# EAGLE design iotpanel (EAGLE 6.4)
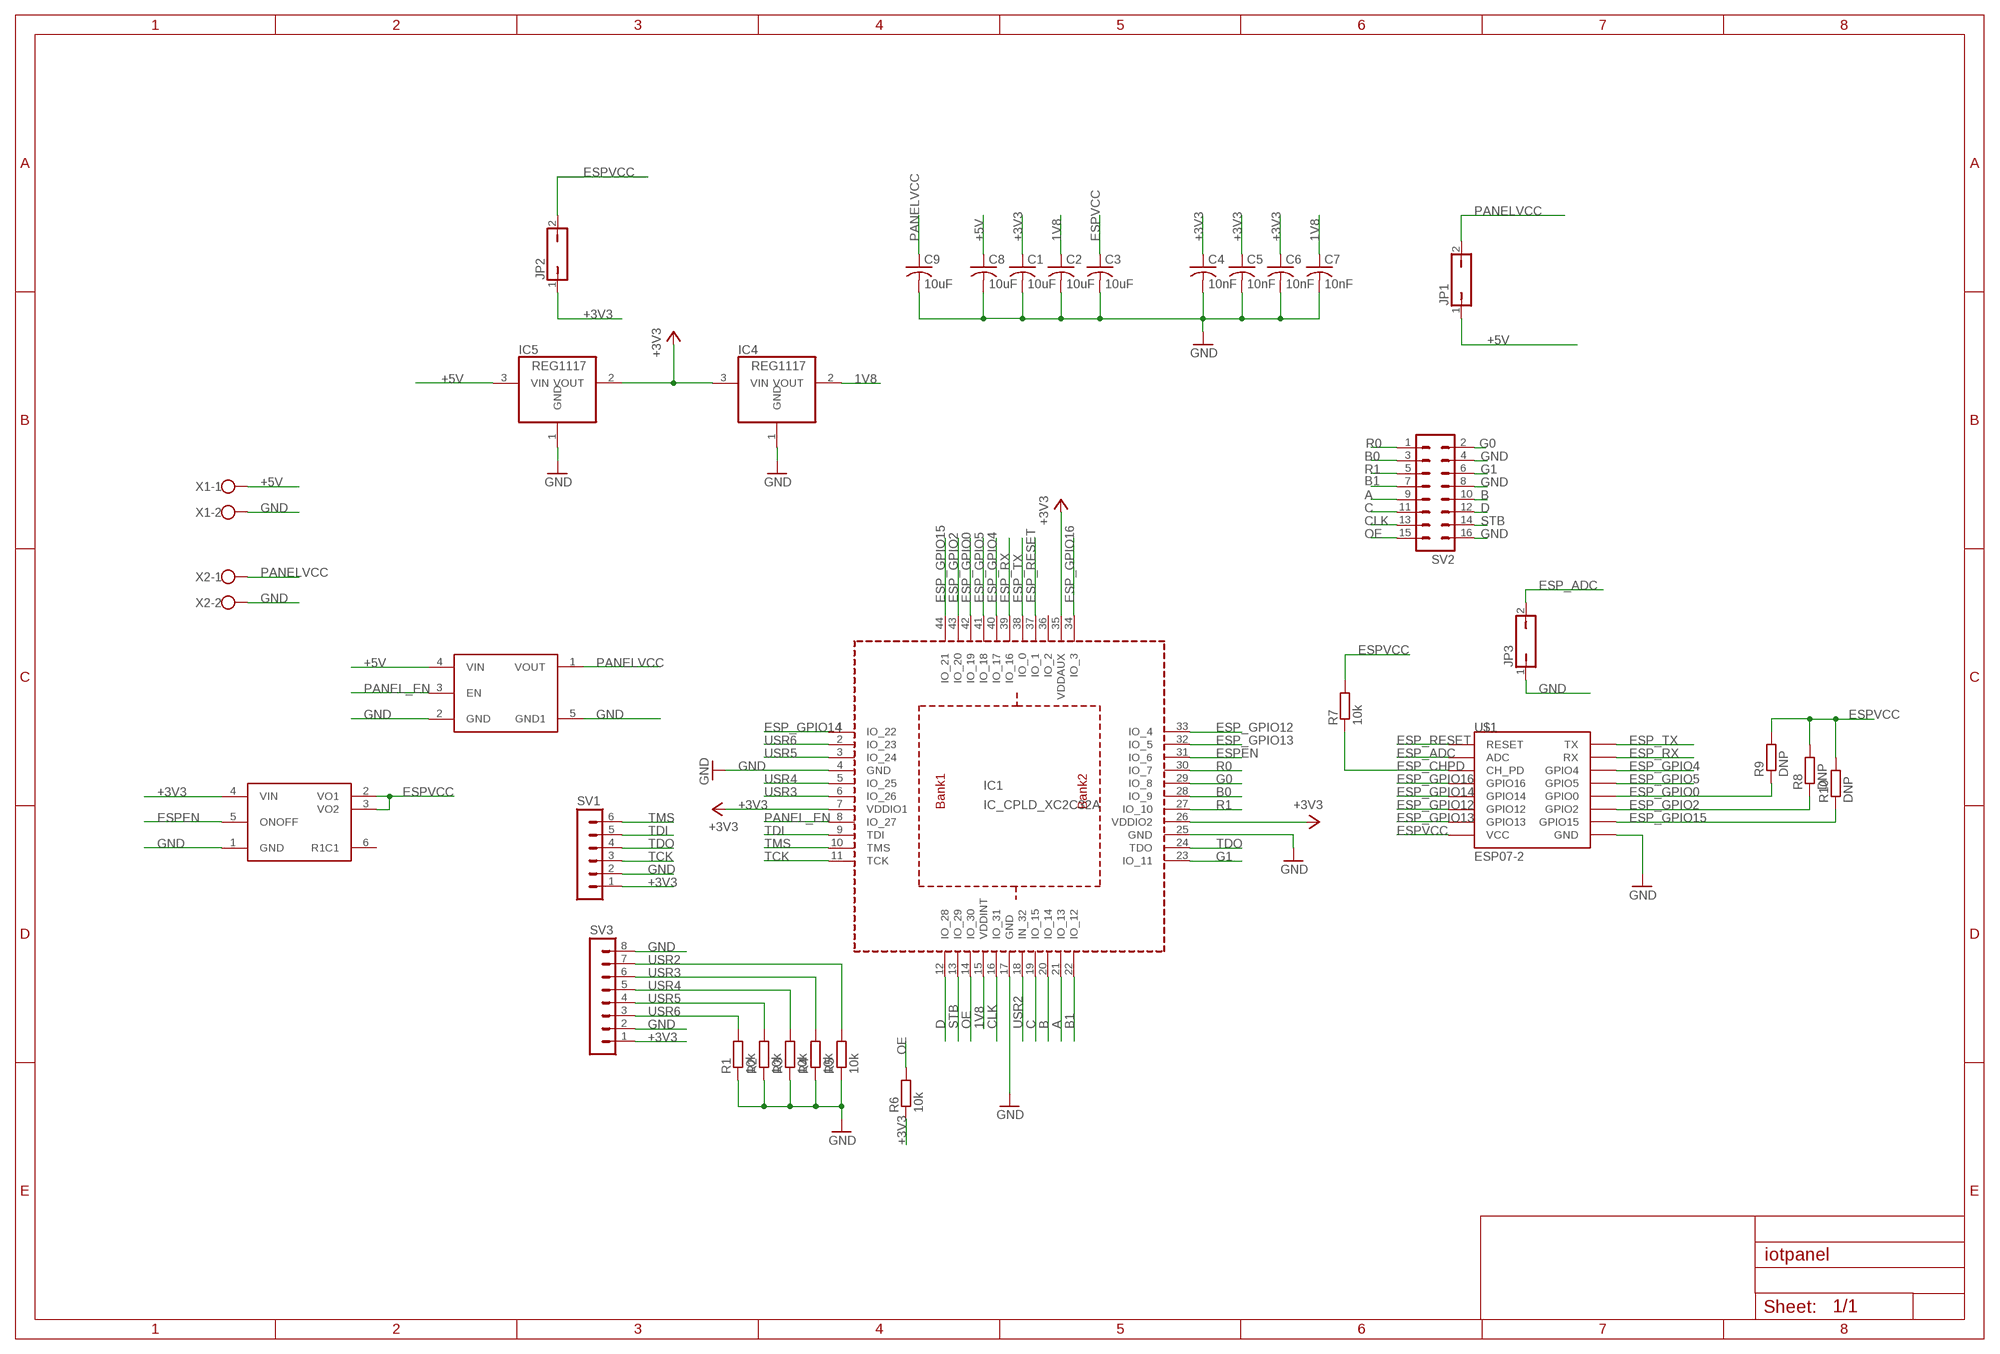
[diagram p0: schematic, sheet 1]

## Parts
C1  10uF  CAPACITOR_-0805  [CAPC0805]
C2  10uF  CAPACITOR_-0805  [CAPC0805]
C3  10uF  CAPACITOR_-0805  [CAPC0805]
C4  10nF  CAPACITOR_-0805  [CAPC0805]
C5  10nF  CAPACITOR_-0805  [CAPC0805]
C6  10nF  CAPACITOR_-0805  [CAPC0805]
C7  10nF  CAPACITOR_-0805  [CAPC0805]
C8  10uF  CAPACITOR_-0805  [CAPC0805]
C9  10uF  CAPACITOR_-0805  [CAPC0805]
IC1  IC_CPLD_XC2C32A  [VQ-44]
IC4  REG1117  [SOT223]
IC5  REG1117  [SOT223]
JP1  JP1Q  [JP1]
JP2  JP1Q  [JP1]
JP3  JP1Q  [JP1]
R1  10k  R-EU_R0805  [R0805]
R2  10k  R-EU_R0805  [R0805]
R3  10k  R-EU_R0805  [R0805]
R4  10k  R-EU_R0805  [R0805]
R5  10k  R-EU_R0805  [R0805]
R6  10k  R-EU_R0805  [R0805]
R7  10k  R-EU_R0805  [R0805]
R8  DNP  R-EU_R0805  [R0805]
R9  DNP  R-EU_R0805  [R0805]
R10  DNP  R-EU_R0805  [R0805]
SV1  MA06-1  [MA06-1]
SV2  ML16  [ML16]
SV3  MA08-1  [MA08-1]
U$1  ESP07-2  [ESP07-2]
U$2  MIC9406XBC6  [SC70-6L]
U$3  SI1867DL  [SC70-6L]
X1  W237-102  [W237-102]
X2  W237-102  [W237-102]

## Nets
1V8: C2.1 C7.1 IC1.15(VDDINT) IC4.2(VOUT)
+3V3: C1.1 C4.1 C5.1 C6.1 IC1.7(VDDIO1) IC1.26(VDDIO2) IC1.35(VDDAUX) IC4.3(VIN) IC5.2(VOUT) JP2.1 R6.1 SV1.1 SV3.1 U$3.4(VIN)
+5V: C8.1 IC5.3(VIN) JP1.1 U$2.4(VIN) X1.1
A: IC1.21(IO_13) SV2.9
B: IC1.20(IO_14) SV2.10
B0: IC1.28(IO_9) SV2.3
B1: IC1.22(IO_12) SV2.7
C: IC1.19(IO_15) SV2.11
CLK: IC1.16(IO_31) SV2.13
D: IC1.12(IO_28) SV2.12
ESP_ADC: JP3.2 U$1.ADC
ESP_CHPD: R7.1 U$1.CH_PD
ESP_GPIO0: IC1.42(IO_19) R9.1 U$1.GPIO0
ESP_GPIO2: IC1.43(IO_20) R8.1 U$1.GPIO2
ESP_GPIO4: IC1.40(IO_17) U$1.GPIO4
ESP_GPIO5: IC1.41(IO_18) U$1.GPIO5
ESP_GPIO12: IC1.33(IO_4) U$1.GPIO12
ESP_GPIO13: IC1.32(IO_5) U$1.GPIO13
ESP_GPIO14: IC1.1(IO_22) U$1.GPIO14
ESP_GPIO15: IC1.44(IO_21) R10.1 U$1.GPIO15
ESP_GPIO16: IC1.34(IO_3) U$1.GPIO16
ESP_RESET: IC1.37(IO_1) U$1.REST(RESET)
ESP_RX: IC1.39(IO_16) U$1.RX
ESP_TX: IC1.38(IO_0) U$1.TX
ESPEN: IC1.31(IO_6) U$3.5(ONOFF)
ESPVCC: C3.1 JP2.2 R7.2 R8.2 R9.2 R10.2 U$1.VCC U$3.2(VO1) U$3.3(VO2)
G0: IC1.29(IO_8) SV2.2
G1: IC1.23(IO_11) SV2.6
GND: C1.2 C2.2 C3.2 C4.2 C5.2 C6.2 C7.2 C8.2 C9.2 IC1.4(GND) IC1.17(GND) IC1.25(GND) IC4.1(GND) IC5.1(GND) JP3.1 R1.1 R2.1 R3.1 R4.1 R5.1 SV1.2 SV2.4 SV2.8 SV2.16 SV3.2 SV3.8 U$1.GND U$2.2(GND) U$2.5(GND1) U$3.1(GND) X1.2 X2.2
OE: IC1.14(IO_30) R6.2 SV2.15
PANEL_EN: IC1.8(IO_27) U$2.3(EN)
PANELVCC: C9.1 JP1.2 U$2.1(VOUT) X2.1
R0: IC1.30(IO_7) SV2.1
R1: IC1.27(IO_10) SV2.5
STB: IC1.13(IO_29) SV2.14
TCK: IC1.11(TCK) SV1.3
TDI: IC1.9(TDI) SV1.5
TDO: IC1.24(TDO) SV1.4
TMS: IC1.10(TMS) SV1.6
USR2: IC1.18(IN_32) R5.2 SV3.7
USR3: IC1.6(IO_26) R4.2 SV3.6
USR4: IC1.5(IO_25) R3.2 SV3.5
USR5: IC1.3(IO_24) R2.2 SV3.4
USR6: IC1.2(IO_23) R1.2 SV3.3
Unconnected: IC1.36(IO_2) U$3.6(R1C1)

## Library data of the parts
C1-C9 = EAGLE_BoosterPack_Library:CAPACITOR_
IC1 = dp_devices:IC_CPLD_XC2C32A: xc2c32a_vq44-ian edit this description Auto generated by make-symbol-device-package-bsdl.ulp Rev. 29 Source: xc2c32a_vq44-ian.bsd
IC4 IC5 = burr-brown:REG1117: 800mA and 1A Low Dropout (LDO) Positive Regulator 1.8V, 2.5V, 2.85V, 3.3V, 5V, and Adj; MPN: REG1117; OC_FARNELL: 1097566; OC_NEWARK: 14P6981
JP1-JP3 = jumper:JP1Q: JUMPER
R1-R10 = rcl:R-EU_: RESISTOR, European symbol
SV1 = con-lstb:MA06-1: PIN HEADER; OC_FARNELL: unknown; OC_NEWARK: unknown
SV2 = con-ml:ML16: HARTING; PARTNO: PRPC004DAAN-RC
SV3 = con-lstb:MA08-1: PIN HEADER; OC_FARNELL: unknown; OC_NEWARK: unknown
U$1 = esp8266modules:ESP07-2
U$2 = alvie:MIC9406XBC6
U$3 = alvie:SI1867DL
X1 X2 = con-wago-500:W237-102: WAGO SCREW CLAMP; MPN: 237-102; OC_FARNELL: unknown; OC_NEWARK: 70K9898

## Board
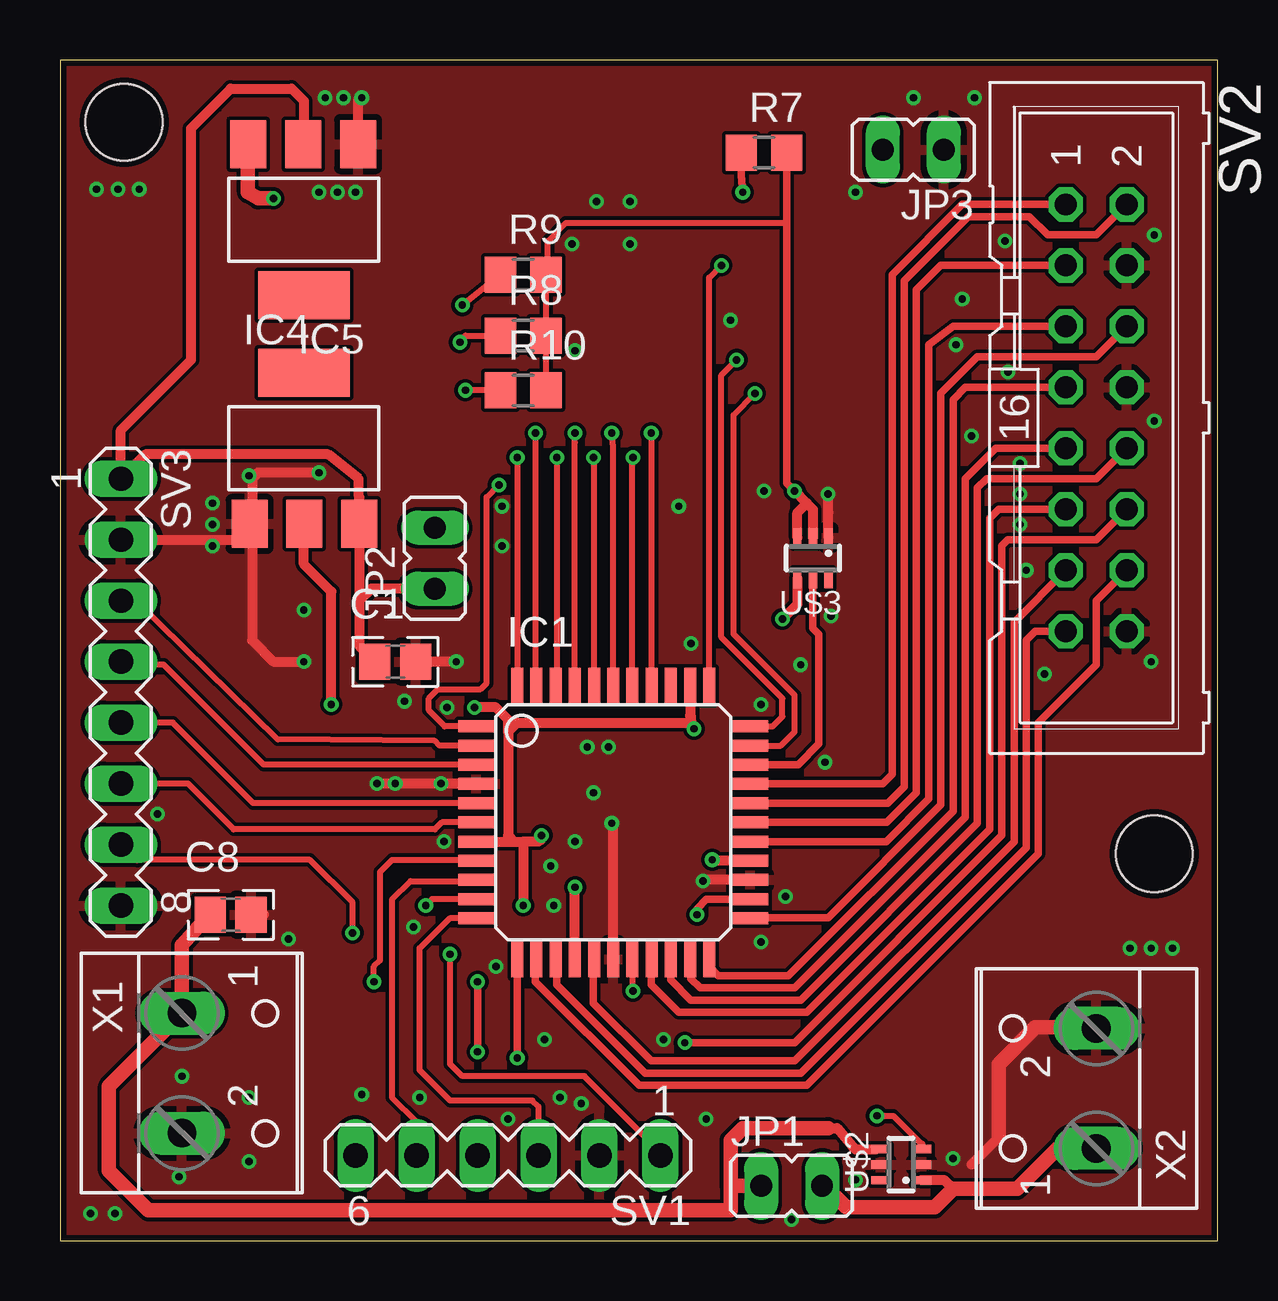
[diagram p1: board, top side]
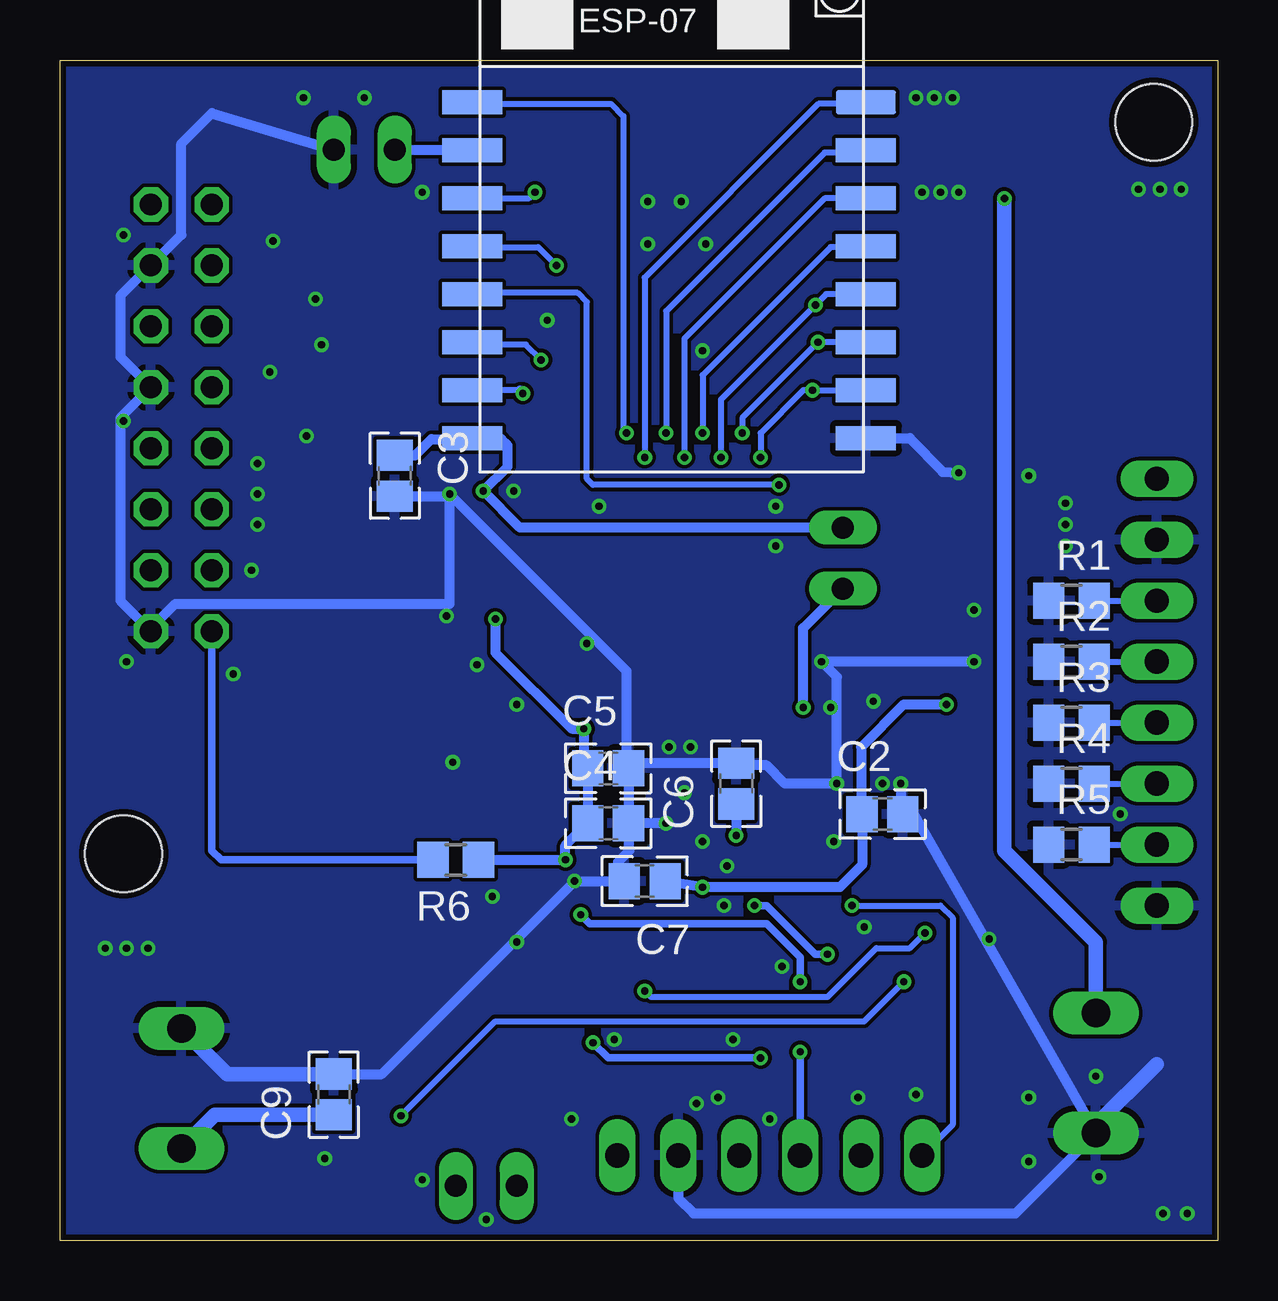
[diagram p2: board, bottom side, seen from below]

Size 48.24 x 49.2 mm. Coordinates in mm from the lower left corner, seen from the top.
Outline: 0,0 48.24,0 48.24,49.2 0,49.2 0,0
Copper layers (1*16): Top 0.035mm / dielectric 1.5mm / Bottom 0.035mm
Design rules "SeeedStudio_2layer_DRU_no_angle_20140221": minimum track width 6mil, minimum drill 12mil, track to track 6mil, track to pad 6mil, pad to pad 6mil, via to via 6mil, smd to smd 0mil, copper to edge 10mil, drill to drill 10mil, minimum pad ring 10mil, minimum via ring 6mil, stop-mask expansion 2mil, vias tented up to drill 100mil, thermal gap 10mil
Holes 3.2 mm at 45.59,16.13 2.67,46.61

### Footprints (pad centres in the part's own frame; a part is rotated, then mirrored left to right if it is on the bottom)
CAPC0805 = smd 1.3 x 1.5: 1 -0.85,0; 2 0.85,0
VQ-44 = smd 1.5 x 0.5: 1 -5.7,4; 2 -5.7,3.2; 3 -5.7,2.4; 4 -5.7,1.6; 5 -5.7,0.8; 6 -5.7,0; 7 -5.7,-0.8; 8 -5.7,-1.6; 9 -5.7,-2.4; 10 -5.7,-3.2; 11 -5.7,-4; 23 5.7,-4; 24 5.7,-3.2; 25 5.7,-2.4; 26 5.7,-1.6; 27 5.7,-0.8; 28 5.7,0; 29 5.7,0.8; 30 5.7,1.6; 31 5.7,2.4; 32 5.7,3.2; 33 5.7,4 | smd 0.5 x 1.5: 12 -4,-5.7; 13 -3.2,-5.7; 14 -2.4,-5.7; 15 -1.6,-5.7; 16 -0.8,-5.7; 17 0,-5.7; 18 0.8,-5.7; 19 1.6,-5.7; 20 2.4,-5.7; 21 3.2,-5.7; 22 4,-5.7; 34 4,5.7; 35 3.2,5.7; 36 2.4,5.7; 37 1.6,5.7; 38 0.8,5.7; 39 0,5.7; 40 -0.8,5.7; 41 -1.6,5.7; 42 -2.4,5.7; 43 -3.2,5.7; 44 -4,5.7
SOT223 = smd 1.499 x 2.007: 1 -2.261,-3.15; 2 0.025,-3.15; 3 2.311,-3.15 | smd 3.81 x 2.007: 4 0,3.15
JP1 = drill 0.914 long: 1 0,-1.27; 2 0,1.27
R0805 = smd 1.3 x 1.5: 1 -0.95,0; 2 0.95,0
MA06-1 = drill 1.016 long: 1 -6.35,0; 2 -3.81,0; 3 -1.27,0; 4 1.27,0; 5 3.81,0; 6 6.35,0
ML16 = drill 0.914 octagon: 1 -8.89,-1.27; 2 -8.89,1.27; 3 -6.35,-1.27; 4 -6.35,1.27; 5 -3.81,-1.27; 6 -3.81,1.27; 7 -1.27,-1.27; 8 -1.27,1.27; 9 1.27,-1.27; 10 1.27,1.27; 11 3.81,-1.27; 12 3.81,1.27; 13 6.35,-1.27; 14 6.35,1.27; 15 8.89,-1.27; 16 8.89,1.27
MA08-1 = drill 1.016 long: 1 -8.89,0; 2 -6.35,0; 3 -3.81,0; 4 -1.27,0; 5 1.27,0; 6 3.81,0; 7 6.35,0; 8 8.89,0
ESP07-2 = smd 2.5 x 1: ADC -8.2,3.53; CH_PD -8.2,1.53; GND 8.2,-8.47; GPIO0 8.2,-2.47; GPIO2 8.2,-4.47; GPIO4 8.2,1.53; GPIO5 8.2,-0.47; GPIO12 -8.2,-4.47; GPIO13 -8.2,-6.47; GPIO14 -8.2,-2.47; GPIO15 8.2,-6.47; GPIO16 -8.2,-0.47; REST -8.2,5.53; RX 8.2,3.53; TX 8.2,5.53; VCC -8.2,-8.47
SC70-6L = smd 0.35 x 0.8: 1 -0.65,-0.85; 2 0,-0.85; 3 0.65,-0.85; 4 0.65,0.85; 5 0,0.85; 6 -0.65,0.85
W237-102 = drill 1.194 long: 1 -2.5,-1.27; 2 2.5,-1.27

### Placement (x,y rotation side)
C1  13.97,24.13 0 top
C2  13.97,17.78 0 bottom
C3  34.29,31.88 270 bottom
C4  25.4,17.4 0 bottom
C5  25.4,19.68 0 bottom
C6  20.07,19.05 90 bottom
C7  23.88,14.99 180 bottom
C8  7.11,13.59 0 top
C9  36.83,6.1 90 bottom
IC1  23.05,17.44 0 top
IC4  10.16,33.02 0 top
IC5  10.16,42.55 180 top
JP1  30.48,2.29 270 top
JP2  15.62,28.45 0 top
JP3  35.56,45.47 90 top
R1  6.1,26.67 0 bottom
R2  6.1,24.13 0 bottom
R3  6.1,21.59 0 bottom
R4  6.1,19.05 0 bottom
R5  6.1,16.51 0 bottom
R6  31.75,15.88 180 bottom
R7  29.34,45.34 0 top
R8  19.3,37.72 0 top
R9  19.3,40.26 0 top
R10  19.3,35.43 0 top
SV1  18.67,3.56 180 top
SV2  43.18,34.29 270 top
SV3  2.54,22.86 270 top
U$1  22.86,41.91 0 bottom
U$2  35.05,3.17 90 top
U$3  31.37,28.45 180 top
X1  6.35,6.99 270 top
X2  41.91,6.35 90 top

### Tracks (layer width: path | path; a pad name or v marks a point on that pad's centre or on a via)
1V8  (via drill 0.3)
  Top 0.406: IC1.15 v21.45,14.72 v21.46,14.73 | v11.3,22.35 11.3,27.05 10.16,28.19 10.16,29.84 IC4.2
  Bottom 0.406: C7.1 v21.46,14.73 15.75,14.73 14.82,15.66 C2.1 14.86,17.82 14.86,20.57 13.08,22.35 v11.3,22.35
+3V3  (via drill 0.3)
  Top 0.254: v16.26,11.94 16.26,7.37 16.76,6.86 21.84,6.86 24.38,4.32 24.38,4.19 SV1.1
  Top 0.406: v30.1,25.91 30.72,26.53 U$3.4 | IC1.35 26.25,21.88 26.29,21.84 26.29,21.72 v26.42,21.34 26.16,21.59 19.05,21.59 18.67,21.21 | IC1.7 18.92,16.64 | 18.92,16.64 19.3,16.64 | 19.3,16.64 v19.3,13.97 | IC1.26 27.22,15.84 v27.18,15.88 | 18.67,21.21 18.67,16.89 18.92,16.64 | v20.07,16.89 20.07,16.76 19.94,16.64 19.3,16.64 | 19.3,16.64 | 12.47,26.67 IC4.3 12.47,30.96 12.45,31.11 12.45,31.75 11.18,32.77 3.56,32.77 SV3.1 2.54,33.78 5.46,36.7 5.46,46.35 7.11,48.01 9.65,48.01 10.16,47.5 10.16,46.35 IC5.2 | 12.47,26.67 12.47,24.78 C1.1 | JP2.1 12.98,27.18 12.47,26.67 | 18.67,21.21 18.67,21.72 18.16,22.23 v17.27,22.23
  Bottom 0.305: v16.26,11.94 16.76,11.94 18.8,13.97 v19.3,13.97
  Bottom 0.406: v30.1,25.91 30.1,24.51 26.92,21.34 v26.42,21.34 26.42,19.85 C5.1 C4.1 27.18,16.47 v27.18,15.88 R6.1 | C6.1 v20.07,16.89 | v17.27,22.23 17.27,25.53 JP2.1
+5V  (via drill 0.3)
  Top 0.305: U$2.4 33.98,3.83 33.98,3.81
  Top 0.406: 32,4.7 32.38,4.7 33.02,3.94 33.15,3.81 33.98,3.81
  Top 0.61: 27.94,2.29 27.94,4.19 28.45,4.7 32,4.7 | JP1.1 27.94,2.29 | 27.94,2.29 27.94,1.27 3.68,1.27 2.03,2.92 2.03,6.44 X1.1 5.08,12.32 6.1,13.46 C8.1 | v8.89,43.43 8.26,43.43 7.82,43.69 IC5.3
  Bottom 0.61: X1.1 5.08,12.45 8.89,16.26 v8.89,43.43
A
  Top 0.305: SV2.9 38.99,33.02 37.72,31.75 37.72,17.65 30.61,10.54 26.67,10.54 26.29,10.92 26.29,11.7
  Top 0.406: 26.29,11.7 IC1.21
B
  Top 0.305: SV2.10 43.18,31.75 38.61,31.75 38.23,31.37 38.23,17.4 30.86,10.03 26.29,10.03 25.45,10.87 IC1.20
B0
  Top 0.305: IC1.28 34.45,17.44 35.69,18.67 35.69,39.62 36.7,40.64 SV2.3
B1
  Top 0.305: SV2.7 37.72,35.56 37.21,35.05 37.21,17.91 30.35,11.05 27.43,11.05 27.05,11.43
  Top 0.406: 27.05,11.43 IC1.22
C
  Top 0.305: SV2.11 39.12,30.48 38.73,30.1 38.73,17.14 31.11,9.53 25.78,9.53 24.64,10.67 24.64,11.72
  Top 0.406: 24.64,11.72 IC1.19
CLK
  Top 0.305: SV2.13 39.75,25.78 39.75,16.64 30.61,7.49 24.64,7.49 22.23,9.91 22.23,11.71
  Top 0.406: 22.23,11.71 IC1.16
D  (via drill 0.3)
  Top 0.305: SV2.12 43.18,29.21 39.5,29.21 39.24,28.96 39.24,16.89 30.61,8.26 v26.04,8.26 | v19.05,7.62 IC1.12 | IC1.12
  Bottom 0.305: v26.04,8.26 25.4,7.62 v19.05,7.62
ESP_ADC
  Bottom 0.406: JP3.2 31.09,45.47 U$1.ADC
ESP_CHPD  (via drill 0.3)
  Top 0.305: R7.1 28.39,44.39 v28.45,43.69
  Bottom 0.254: U$1.CH_PD 28.7,43.44 v28.45,43.69
  Bottom 0.406: U$1.CH_PD
ESP_GPIO0  (via drill 0.3)
  Top 0.254: v20.7,32.64 20.7,23.19 | R9.1 v16.76,38.99
  Top 0.406: 20.7,23.19 IC1.42
  Bottom 0.254: U$1.GPIO0 16.31,39.44 v16.76,38.99 20.7,35.05 v20.7,32.64
ESP_GPIO2  (via drill 0.3)
  Top 0.254: v19.81,33.66 19.81,23.18 | v16.66,37.44 16.89,37.72 R8.1
  Top 0.406: 19.81,23.18 IC1.43
  Bottom 0.254: v19.81,33.66 19.81,34.29 v16.66,37.44 U$1.GPIO2
  Bottom 0.305: 14.62,37.4 U$1.GPIO2
ESP_GPIO4  (via drill 0.3)
  Top 0.254: IC1.40 22.25,32.49 v22.23,32.64
  Bottom 0.254: U$1.GPIO4 16.38,43.43 22.23,37.59 v22.23,32.64
  Bottom 0.406: U$1.GPIO4
ESP_GPIO5  (via drill 0.3)
  Top 0.254: IC1.41 21.45,33.26 v21.46,33.66
  Bottom 0.254: 14.7,41.4 16.13,41.4 21.46,36.07 v21.46,33.66
  Bottom 0.406: 14.7,41.4 U$1.GPIO5
ESP_GPIO12  (via drill 0.3)
  Top 0.254: IC1.33 29.69,21.44 30.1,21.84 30.1,22.61 27.56,25.15 27.56,36.07 v28.19,36.7
  Bottom 0.254: v28.19,36.7 28.83,37.34 30.96,37.34
  Bottom 0.406: 30.96,37.34 U$1.GPIO12
ESP_GPIO13  (via drill 0.3)
  Top 0.254: IC1.32 30.04,20.64 30.61,21.21 30.61,22.73 28.07,25.27 28.07,34.42 v28.96,35.31
  Bottom 0.254: 29.08,35.43 U$1.GPIO13
  Bottom 0.406: v28.96,35.31 29.08,35.43 | U$1.GPIO13
ESP_GPIO14  (via drill 0.3)
  Top 0.254: IC1.1 16.03,21.44 15.37,22.1 15.37,22.61 15.75,22.99 17.53,22.99 17.78,23.24 17.78,30.99 v18.29,31.5
  Bottom 0.254: v18.29,31.5 26.04,31.5 26.29,31.75 26.29,39.12 26.67,39.5 31,39.5
  Bottom 0.406: 31,39.5 U$1.GPIO14
ESP_GPIO15  (via drill 0.3)
  Top 0.254: v19.05,32.64 IC1.44 | R10.1 v16.88,35.43 v16.89,35.44
  Top 0.406: IC1.44
  Bottom 0.254: v19.05,32.64 19.05,33.66 17.27,35.44 v16.89,35.44 U$1.GPIO15
ESP_GPIO16  (via drill 0.3)
  Top 0.254: IC1.34 27.05,24.51 27.05,30.48 27.05,40.13 v27.56,40.64
  Bottom 0.254: 31.02,41.4 28.32,41.4 v27.56,40.64
  Bottom 0.406: 31.02,41.4 U$1.GPIO16
ESP_RESET  (via drill 0.3)
  Top 0.254: IC1.37 24.65,33.64 v24.64,33.66
  Bottom 0.254: 30.99,47.37 25.27,47.37 24.77,46.86 24.77,33.78 v24.64,33.66
  Bottom 0.406: 30.99,47.37 U$1.REST
ESP_RX  (via drill 0.3)
  Top 0.254: IC1.39 23.05,33.08 v22.99,33.66
  Bottom 0.254: 14.76,45.34 16.38,45.34 22.99,38.73 v22.99,33.66
  Bottom 0.406: 14.76,45.34 U$1.RX
ESP_TX  (via drill 0.3)
  Top 0.254: IC1.38 23.85,32.61 v23.88,32.64
  Bottom 0.254: 14.73,47.37 16.64,47.37 23.88,40.13 v23.88,32.64
  Bottom 0.406: 14.73,47.37 U$1.TX
ESPEN
  Top 0.305: IC1.31 30.76,19.84 31.62,20.7 31.62,25.27 31.37,25.53 U$3.5
ESPVCC  (via drill 0.3)
  Top 0.254: R10.2 R8.2 20.25,39.94 | 20.25,39.94 20.32,40.01 20.32,41.66 21.08,42.42 30.29,42.42 | 20.25,39.94 R9.2
  Top 0.305: R7.2 30.29,42.42 30.29,31.56 v30.61,31.24
  Top 0.406: 31.11,30.73 31.37,30.48 U$3.2 | 31.11,30.73 v30.61,31.24 30.71,31.14 | U$3.3 30.72,30.34 31.11,30.73
  Bottom 0.406: JP2.2 29.08,29.72 v30.61,31.24 29.59,32.26 29.59,33.15 29.84,33.4 31.02,33.4 U$1.VCC 31.1,33.4 32.77,33.4 33.44,32.73 C3.1
G0
  Top 0.305: SV2.2 43.18,41.91 41.15,41.91 40.39,42.67 37.85,42.67 35.18,40.01 35.18,18.92 34.49,18.24 IC1.29
G1
  Top 0.305: SV2.6 43.18,36.83 38.23,36.83 36.7,35.31 36.7,18.16 32,13.46 28.77,13.46
  Top 0.406: 28.77,13.46 IC1.23
GND  (via drill 0.3)
  Top 0.406: IC1.25 26.85,15.04 v26.8,14.99 | IC1.17 23.05,17.34 v22.99,17.4 | 32.03,31.09 v32,31.11 32,30.35 32.02,30.34 U$3.1 | 37.97,3.17 39.12,4.32 | IC1.4 15.89,19.04 | 15.89,19.04 v15.88,19.05 | C8.2 8.51,13.59 | 15.89,19.04 13.22,19.04 v13.21,19.05 | v16.51,24.13 C1.2 | SV3.2 7.24,29.21 IC4.1 8,29.97 | v10.79,32 8.26,32 8,31.75 8,29.97 | IC5.1 12.42,47.52 v12.57,47.62 | 8,29.97 8,25.02 8.89,24.13 v10.16,24.13
  Top 0.61: 39.12,4.32 39.12,7.37 40.64,8.89 43.14,8.89 X2.2
  Bottom 0.406: C5.2 24.34,19.9 C6.2 19.98,19.81 18.8,19.81 18.03,19.05 v15.88,19.05 15.88,23.5 v16.51,24.13 v10.16,24.13 | C5.2 C4.2 | 24.98,14.99 v26.8,14.99 34.84,6.95 C9.2 | 24.98,14.99 C7.2 | v22.99,17.4 C4.2 | 24.98,14.99 24.98,15.79 24.51,16.26 24.51,17.36 C4.2 | v32,31.11 24.64,23.75 24.64,19.77 C5.2 | v32,31.11 32,26.54 43.43,26.54 44.45,25.53 SV2.16 45.72,26.67 45.72,34.29 SV2.8 45.72,36.83 45.72,39.37 SV2.4 43.18,41.91 43.18,45.72 41.91,46.99 JP3.1 | v13.21,19.05 13.21,17.87 C2.2 12.66,17.78 X1.2 8.42,1.14 21.84,1.14 22.48,1.78 SV1.2 | C3.2 32.09,31.03 v32,31.11 | U$1.GND 12.83,33.44 11.47,32.04 v10.79,32
  Bottom 0.61: C9.2 41.28,6.95 X2.2 | X1.2 5.08,4.83 2.54,7.37
  other vias: 20.83,5.97 21.72,5.71 14.99,5.97 18.67,5.08 9.53,12.57 6.35,30.73 20.57,13.97 1.27,1.14 2.29,1.14 44.58,12.19 45.47,12.19 46.35,12.19 45.47,24.13 45.59,34.16 45.59,41.91 37.34,37.34 37.59,39.24 37.97,33.53 30.86,24 29.21,22.35 30.23,14.35 29.21,12.45 18.16,11.43 26.29,24.89 30.48,0.89 35.56,47.62 38.1,47.62 31.88,19.94 32.13,26.04 21.97,20.57 22.86,20.57 22.23,18.67 20.45,15.62 21.46,16.64 1.52,43.81 2.41,43.81 3.3,43.81 11.81,47.62 10.16,26.29 6.35,28.96 13.97,19.05 16,16.64 4.06,17.78 14.35,22.48 14.73,13.08 20.19,8.38 25.15,8.38 16.13,22.23 7.87,3.3 7.87,5.97 5.08,6.86 4.95,2.67 18.41,30.61 18.41,28.96 23.75,41.53 22.35,43.31 23.75,43.31 21.34,41.53 27.94,38.35 29.34,31.24 25.78,30.61 6.35,29.84 11.05,47.62 12.32,43.69 11.56,43.69 10.79,43.69 7.87,31.88 33.15,43.69 21.46,37.08 26.92,5.08 33.15,2.54 37.21,3.43 12.57,6.1 39.37,41.66 39.5,36.2 40.01,32.38 40.01,31.11 40.01,29.84 40.26,27.94 41.02,23.62
  pour Bottom: 0,0 0,49.53 48.26,49.53 48.26,0
  pour Top: 0,49.53 48.26,49.53 48.26,0 0,0
OE
  Top 0.305: SV2.15 40.64,25.4 40.26,25.02 40.26,16.38 30.86,6.99 24.38,6.99 20.7,10.67 20.7,11.69
  Top 0.406: 20.7,11.69 IC1.14
  Bottom 0.305: R6.2 41.53,15.88 41.91,16.26 SV2.15
PANEL_EN  (via drill 0.3)
  Top 0.254: v34.04,5.21 34.72,5.21 35.9,4.03 | v13.08,10.79 13.08,11.43 13.34,11.68 13.34,15.37 13.84,15.88 17.31,15.88
  Top 0.305: U$2.3 35.9,4.03
  Top 0.406: 17.31,15.88 IC1.8
  Bottom 0.254: v34.04,5.21 30.1,9.14 14.73,9.14 v13.08,10.79
PANELVCC
  Top 0.406: 37.34,2.16 37.21,2.16 36.83,2.54 35.92,2.54 U$2.1
  Top 0.61: X2.1 41.57,3.85 39.88,2.16 37.34,2.16 | JP1.2 32.38,1.78 32.77,1.4 36.45,1.4 37.21,2.16
  Bottom 0.61: C9.1 41.78,5.25 X2.1
R0
  Top 0.305: IC1.30 34.28,19.04 34.67,19.43 34.67,40.26 37.59,43.18 SV2.1
R1
  Top 0.305: SV2.5 37.21,38.1 36.2,37.34 36.2,18.41 34.42,16.64 IC1.27
  Top 0.406: IC1.27
STB
  Top 0.305: SV2.14 43.18,26.67 43.18,24 40.77,21.59 40.77,16.13 31.11,6.48 24.13,6.48 19.81,10.79 19.81,11.7
  Top 0.406: 19.81,11.7 IC1.13
TCK
  Top 0.254: SV1.3 19.94,5.59 19.68,5.84 16.26,5.84 14.99,7.11 14.99,12.19 16.23,13.44 IC1.11
TDI
  Top 0.254: SV1.5 14.86,4.95 13.84,5.97 13.84,14.22 14.61,14.99 17.3,14.99
  Top 0.406: 17.3,14.99 IC1.9
TDO  (via drill 0.3)
  Top 0.305: v26.54,13.59 26.54,13.84 26.92,14.22 28.74,14.22 | v17.4,7.87 v17.4,10.79
  Top 0.406: 28.74,14.22 IC1.24
  Bottom 0.305: v26.54,13.59 26.16,13.21 18.8,13.21 17.4,11.81 v17.4,10.79 | SV1.4 v17.4,7.87
TMS  (via drill 0.3)
  Top 0.254: IC1.10 15.51,14.24 v15.24,13.97
  Bottom 0.254: v15.24,13.97 11.56,13.97 11.05,13.46 11.05,4.83 SV1.6
USR2  (via drill 0.3)
  Top 0.254: SV3.7 3.21,15.84 3.25,15.88 10.41,15.88 12.19,14.1 v12.19,12.83 | IC1.18 23.85,10.44
  Top 0.406: 23.85,10.44 v23.88,10.41
  Bottom 0.254: v23.88,10.41 23.62,10.16 16.26,10.16 14.22,12.19 12.83,12.19 v12.19,12.83 | R5.2 SV3.7
USR3
  Top 0.254: IC1.6 15.91,17.44 15.62,17.14 7.24,17.14 5.33,19.05 SV3.6
  Bottom 0.254: R4.2 SV3.6
USR4
  Top 0.254: IC1.5 8.05,18.24 4.7,21.59 SV3.5
  Bottom 0.254: R3.2 SV3.5
USR5
  Top 0.254: IC1.3 8.48,19.84 4.32,24 2.67,24 SV3.4
  Bottom 0.254: R2.2 SV3.4
USR6
  Top 0.254: IC1.2 15.81,20.64 15.62,20.83 9.08,20.89 3.17,26.67
  Top 0.406: 3.17,26.67 SV3.3
  Bottom 0.254: R1.2 SV3.3

### Text on the board
tOrigins: ADC | GND | +3v3 | GND | IoT Panel | (C) Alvie 2015 | 1 | GND | + | + | TMS | TDI | TDO | TCK | GND | VREF